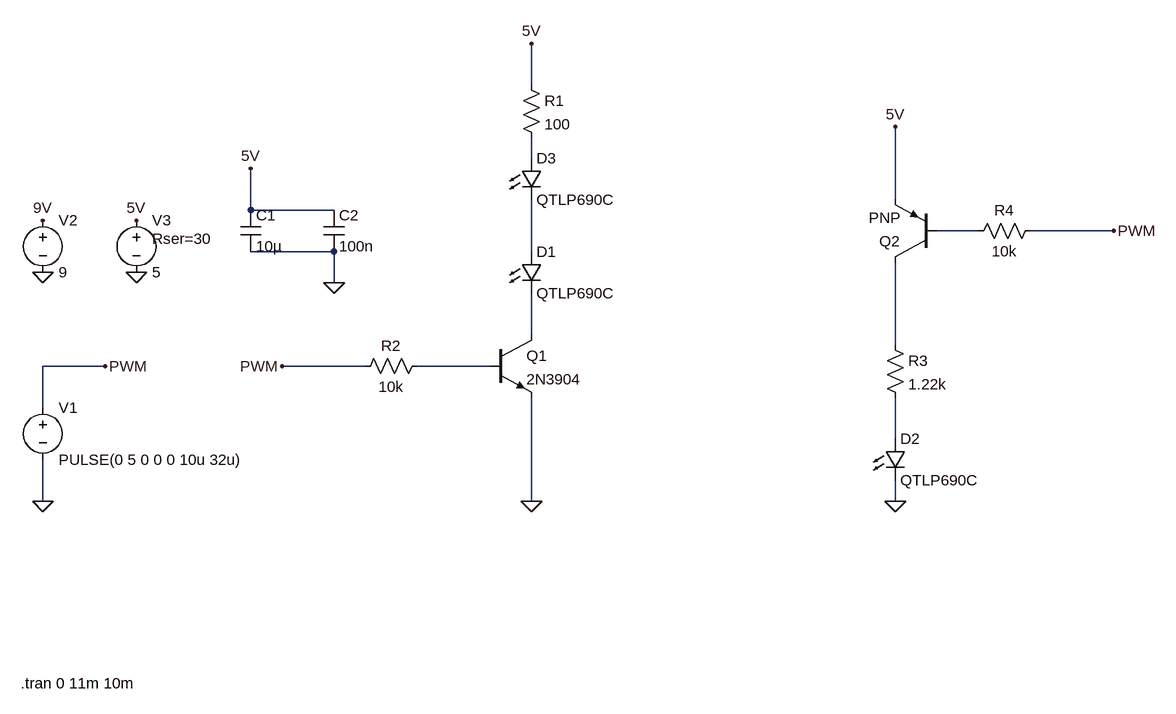
[diagram p0: schematic LED_Drivers.asc]
LED_Drivers.asc, the LTspice schematic file:
Version 4
SHEET 1 1500 680
WIRE 528 -352 528 -416
WIRE 528 -240 528 -272
WIRE 1088 -176 1088 -288
WIRE 96 -160 96 -224
WIRE 224 -160 96 -160
WIRE 1216 -128 1152 -128
WIRE 1424 -128 1296 -128
WIRE 224 -96 96 -96
WIRE 528 -96 528 -176
WIRE 224 -48 224 -96
WIRE 528 32 528 -32
WIRE 1088 48 1088 -80
WIRE -128 80 -224 80
WIRE 272 80 144 80
WIRE 464 80 352 80
WIRE -224 144 -224 80
WIRE 1088 192 1088 128
WIRE -224 288 -224 224
WIRE 528 288 528 128
WIRE 1088 288 1088 256
FLAG -224 -64 0
FLAG -224 -144 9V
FLAG -80 -64 0
FLAG -80 -144 5V
FLAG -224 288 0
FLAG 528 288 0
FLAG 528 -416 5V
FLAG -128 80 PWM
FLAG 144 80 PWM
FLAG 1088 288 0
FLAG 1424 -128 PWM
FLAG 1088 -288 5V
FLAG 96 -224 5V
FLAG 224 -48 0
SYMBOL voltage -224 128 R0
WINDOW 123 0 0 Left 2
WINDOW 39 0 0 Left 2
SYMATTR InstName V1
SYMATTR Value PULSE(0 5 0 0 0 10u 32u)
SYMBOL npn 464 32 R0
SYMATTR InstName Q1
SYMATTR Value 2N3904
SYMBOL LED 512 -96 R0
SYMATTR InstName D1
SYMATTR Value QTLP690C
SYMATTR Description Diode
SYMATTR Type diode
SYMBOL res 512 -368 R0
SYMATTR InstName R1
SYMATTR Value 100
SYMBOL voltage -224 -160 R0
WINDOW 123 0 0 Left 2
WINDOW 39 0 0 Left 2
SYMATTR InstName V2
SYMATTR Value 9
SYMBOL voltage -80 -160 R0
WINDOW 123 0 0 Left 2
WINDOW 39 24 44 Left 2
SYMATTR InstName V3
SYMATTR Value 5
SYMATTR SpiceLine Rser=30
SYMBOL res 368 64 R90
WINDOW 0 0 56 VBottom 2
WINDOW 3 32 56 VTop 2
SYMATTR InstName R2
SYMATTR Value 10k
SYMBOL LED 1072 192 R0
SYMATTR InstName D2
SYMATTR Value QTLP690C
SYMATTR Description Diode
SYMATTR Type diode
SYMBOL res 1072 32 R0
SYMATTR InstName R3
SYMATTR Value 1.22k
SYMBOL pnp 1152 -80 R180
SYMATTR InstName Q2
SYMBOL res 1200 -112 R270
WINDOW 0 32 56 VTop 2
WINDOW 3 0 56 VBottom 2
SYMATTR InstName R4
SYMATTR Value 10k
SYMBOL LED 512 -240 R0
SYMATTR InstName D3
SYMATTR Value QTLP690C
SYMATTR Description Diode
SYMATTR Type diode
SYMBOL cap 80 -160 R0
SYMATTR InstName C1
SYMATTR Value 10µ
SYMBOL cap 208 -160 R0
SYMATTR InstName C2
SYMATTR Value 100n
TEXT -258 568 Left 2 !.tran 0 11m 10m

The netlist it stands for:
* LED_Drivers.asc
V1 PWM 0 PULSE(0 5 0 0 0 10u 32u)
Q1 N004 N006 0 0 2N3904
D1 N003 N004 QTLP690C
R1 5V N001 100
V2 9V 0 9
V3 5V 0 5 Rser=30
R2 N006 PWM 10k
D2 N007 0 QTLP690C
R3 N005 N007 1.22k
Q2 N005 N002 5V 0 PNP
R4 N002 PWM 10k
D3 N001 N003 QTLP690C
C1 5V 0 10µ
C2 5V 0 100n
.model D D
.lib standard.dio
.model NPN NPN
.model PNP PNP
.lib standard.bjt
.tran 0 11m 10m
.backanno
.end